# EAGLE design OK předzesilovač (EAGLE 9.6.2)
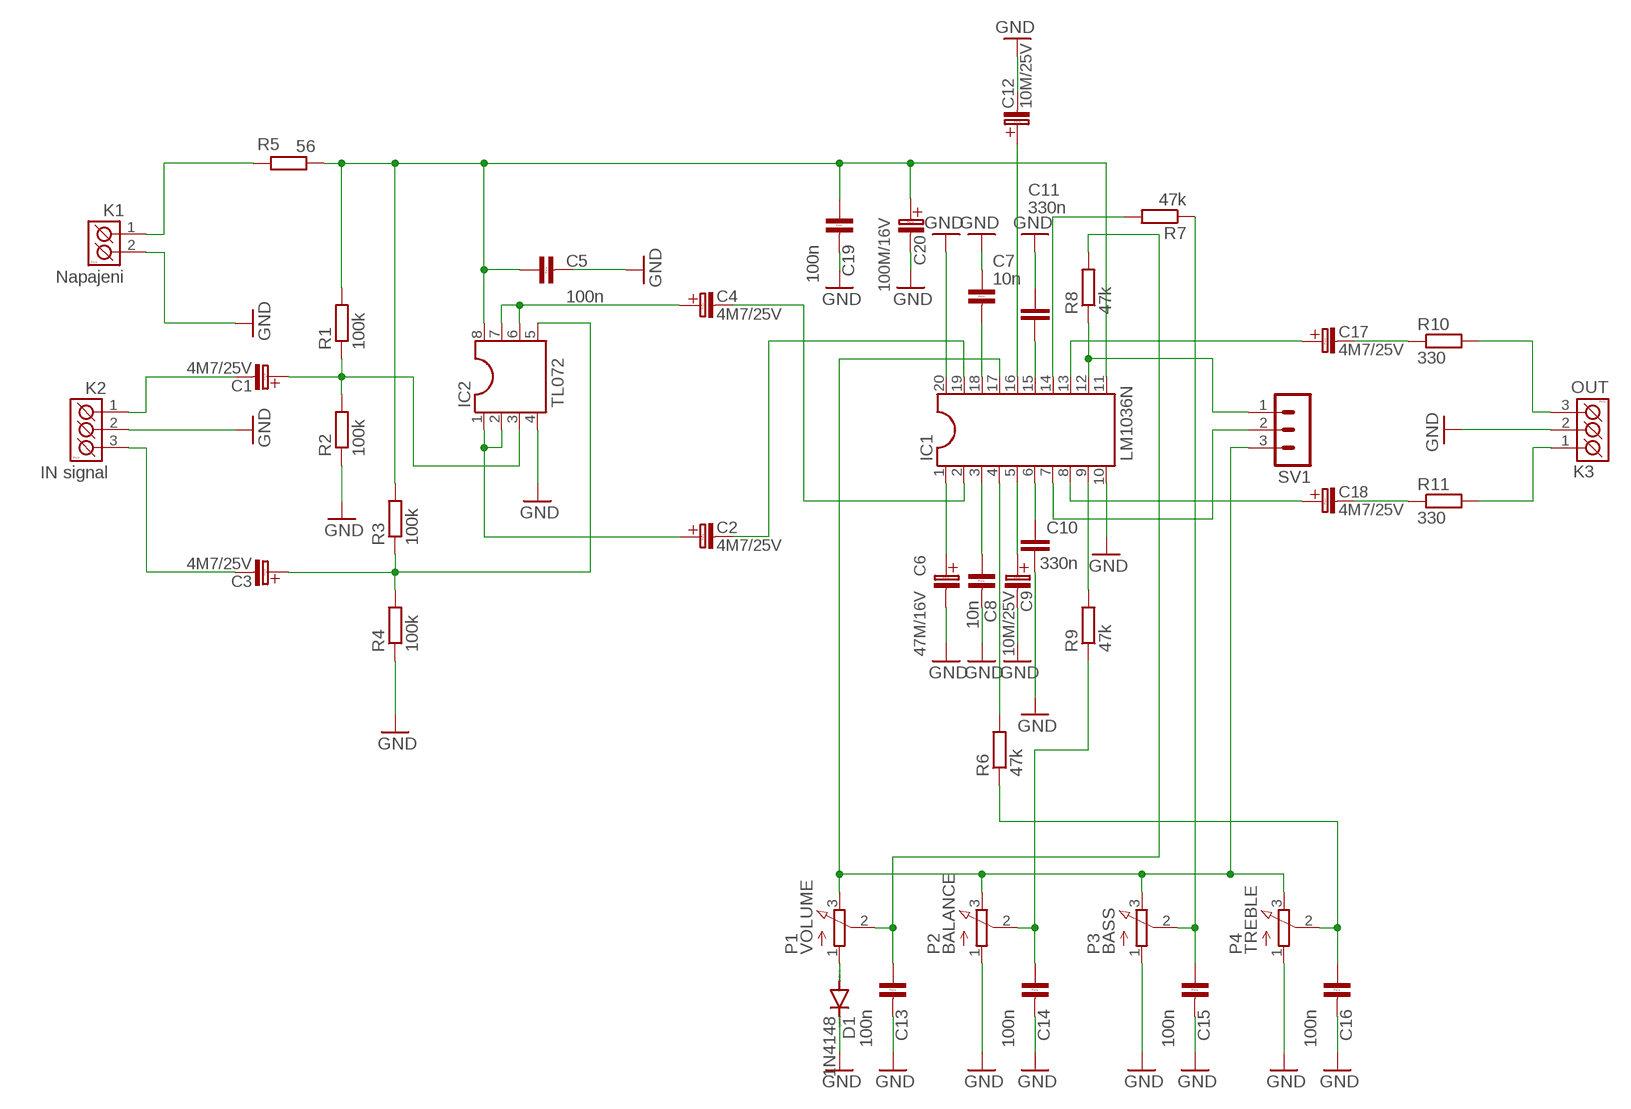
[diagram p0: schematic, sheet 1]

## Parts
C1  4M7/25V  4M7/63V  [C_EL_2]
C2  4M7/25V  4M7/63V  [C_EL_2]
C3  4M7/25V  4M7/63V  [C_EL_2]
C4  4M7/25V  4M7/63V  [C_EL_2]
C5  100n  100N-J/63V  [RM5_2,5]
C6  47M/16V  47M/10V  [C_EL_2]
C7  10n  10N-J/63V  [RM5_2,5]
C8  10n  10N-J/63V  [RM5_2,5]
C9  10M/25V  10M/100V  [C_EL_2,5]
C10  330n  C-EU075-032X103  [C075-032X103]
C11  330n  C-EU075-032X103  [C075-032X103]
C12  10M/25V  10M/100V  [C_EL_2,5]
C13  100n  100N-J/63V  [RM5_2,5]
C14  100n  100N-J/63V  [RM5_2,5]
C15  100n  100N-J/63V  [RM5_2,5]
C16  100n  100N-J/63V  [RM5_2,5]
C17  4M7/25V  4M7/63V  [C_EL_2]
C18  4M7/25V  4M7/63V  [C_EL_2]
C19  100n  100N-J/63V  [RM5_2,5]
C20  100M/16V  100M/50V  [C_EL_3,5]
D1  1N4148  1N4148DO35-7  [DO35-7]
IC1  LM1036N  DIL20  [DIL20]
IC2  TL072  DIL8  [DIL08]
K1  Napajeni  ARK500/2  [ARK500/2]
K2  IN signal  ARK500/3  [ARK500/3]
K3  OUT  ARK500/3  [ARK500/3]
P1  VOLUME  3RP/1610N  [3RP/1610N]
P2  BALANCE  3RP/1610N  [3RP/1610N]
P3  BASS  3RP/1610N  [3RP/1610N]
P4  TREBLE  3RP/1610N  [3RP/1610N]
R1  100k  R-EU_0207/12  [0207/12]
R2  100k  R-EU_0204/7  [0204/7]
R3  100k  R-EU_0204/7  [0204/7]
R4  100k  R-EU_0204/7  [0204/7]
R5  56  R-EU_0204/7  [0204/7]
R6  47k  R-EU_0207/12  [0207/12]
R7  47k  R-EU_0207/12  [0207/12]
R8  47k  R-EU_0207/12  [0207/12]
R9  47k  R-EU_0207/12  [0207/12]
R10  330  R-EU_0204/7  [0204/7]
R11  330  R-EU_0207/12  [0207/12]
SV1  MA03-1  [MA03-1]

## Nets
GND: C5.2 C6.C-(C_EL-) C7.1 C8.2 C9.C-(C_EL-) C10.2 C11.1 C12.C-(C_EL-) C13.2 C14.2 C15.2 C16.2 C19.2 C20.C-(C_EL-) D1.C IC1.10 IC1.20 IC2.4 K1.2(K2) K2.2(K2) K3.2(K2) P2.1(A) P3.1(A) P4.1(A) R2.1 R4.1
N$1: K3.1(K1) R11.2
N$2: K1.1(K1) R5.2
N$3: C1.C-(C_EL-) K2.1(K1)
N$4: C3.C+(C_EL+) IC2.5 R3.1 R4.2
N$5: C3.C-(C_EL-) K2.3(K3)
N$6: C4.C+(C_EL+) IC2.6 IC2.7
N$7: IC1.14 R7.2
N$8: D1.A P1.1(A)
N$9: C1.C+(C_EL+) IC2.3 R1.1 R2.2
N$10: C2.C+(C_EL+) IC2.1 IC2.2
N$11: C2.C-(C_EL-) IC1.19
N$12: C4.C-(C_EL-) IC1.2
N$13: C6.C+(C_EL+) IC1.1
N$14: C9.C+(C_EL+) IC1.5
N$15: C11.2 IC1.15
N$16: C7.2 IC1.18
N$18: C13.1 P1.2(S) R8.2
N$19: C14.1 P2.2(S) R9.1
N$20: C15.1 P3.2(S) R7.1
N$21: C16.1 P4.2(S) R6.1
N$22: IC1.7 SV1.2
N$23: C12.C+(C_EL+) IC1.16
N$24: K3.3(K3) R10.2
N$25: C17.C-(C_EL-) R10.1
N$26: C17.C+(C_EL+) IC1.13
N$27: IC1.17 P1.3(E) P2.3(E) P3.3(E) P4.3(E) SV1.3
N$28: C10.1 IC1.6
N$29: C18.C+(C_EL+) IC1.8
N$30: C18.C-(C_EL-) R11.1
N$31: C8.1 IC1.3
N$32: IC1.4 R6.2
N$33: IC1.12 R8.1 SV1.1
N$35: C5.1 C19.1 C20.C+(C_EL+) IC1.11 IC2.8 R1.2 R3.2 R5.1
N$36: IC1.9 R9.2

## Library data of the parts
C1-C4 C17 C18 = #PaJa_C-el_2:4M7/63V
C5 C13-C16 C19 = #PaJa_C-folie:100N-J/63V
C6 = #PaJa_C-el_2:47M/10V
C7 C8 = #PaJa_C-folie:10N-J/63V
C9 C12 = #PaJa_C-el_2:10M/100V
C10 C11 = rcl:C-EU: CAPACITOR, European symbol; SPICEPREFIX: C
C20 = #PaJa_C-el_2:100M/50V
D1 = diode:1N4148: DIODE high speed (Philips)
IC1 = ic-package:DIL20: Dual In Line / Socket
IC2 = ic-package:DIL8: Dual In Line / Socket
K1 = #PaJa_konektory:ARK500/2: Svorkovnice - roztec 5mm - dvojita
K2 K3 = #PaJa_konektory:ARK500/3: Svorkovnice - roztec 5mm - trojita
P1-P4 = pot:3RP/1610N: 16mm Potentiometer one level Source: http://www.alphapotentiometers.net/html/16mm_pot_2.html
R1-R11 = rcl:R-EU_: RESISTOR, European symbol; SPICEPREFIX: R
SV1 = con-lstb:MA03-1: PIN HEADER; OC_FARNELL: unknown; OC_NEWARK: unknown

## Board
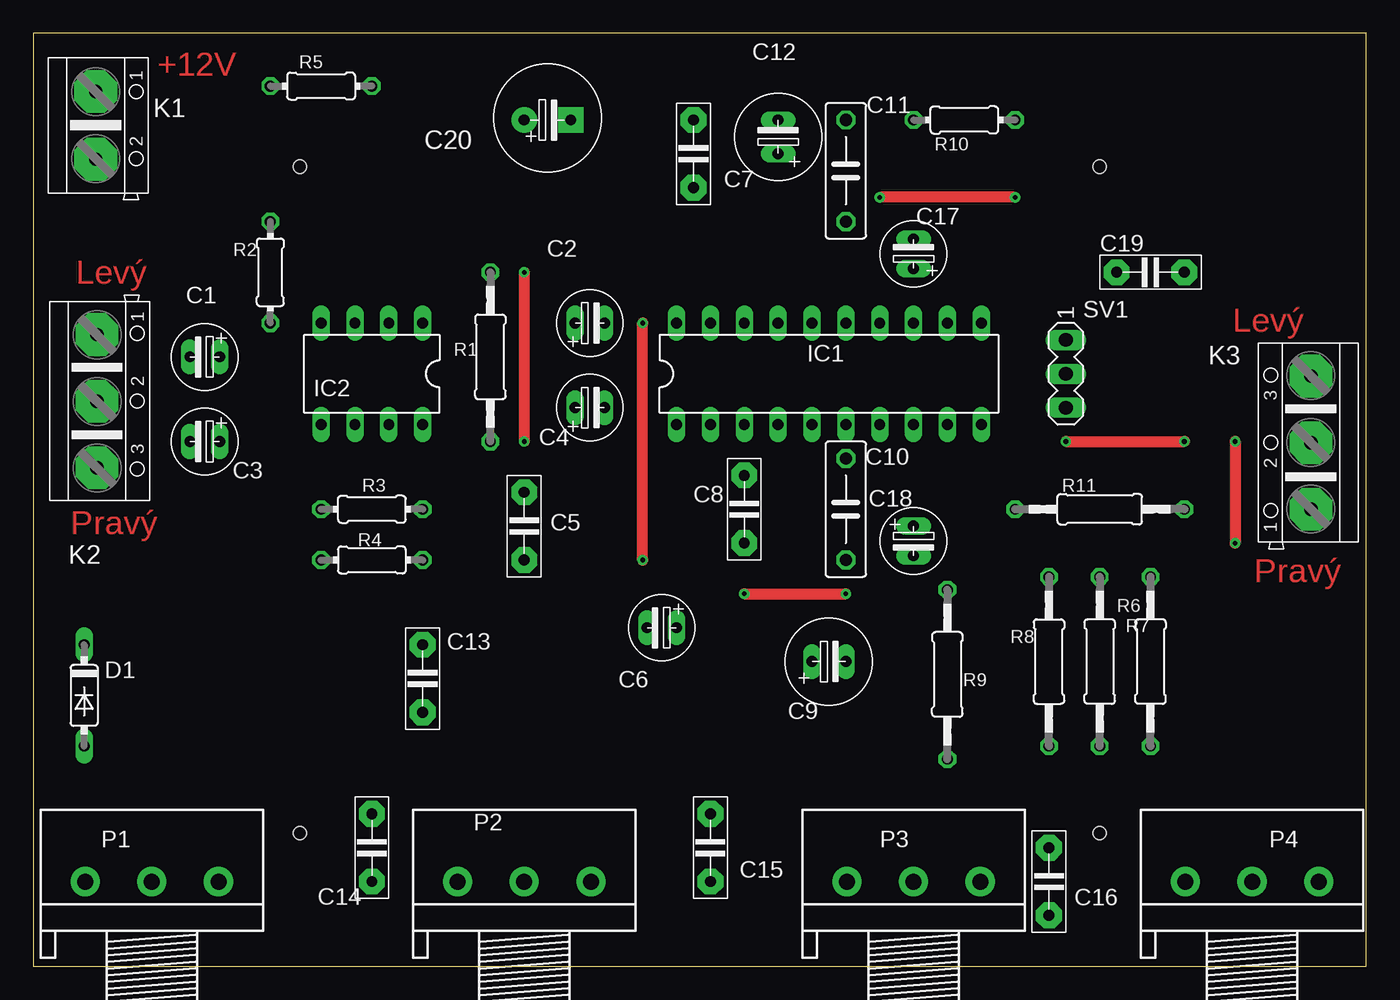
[diagram p1: board, top side]
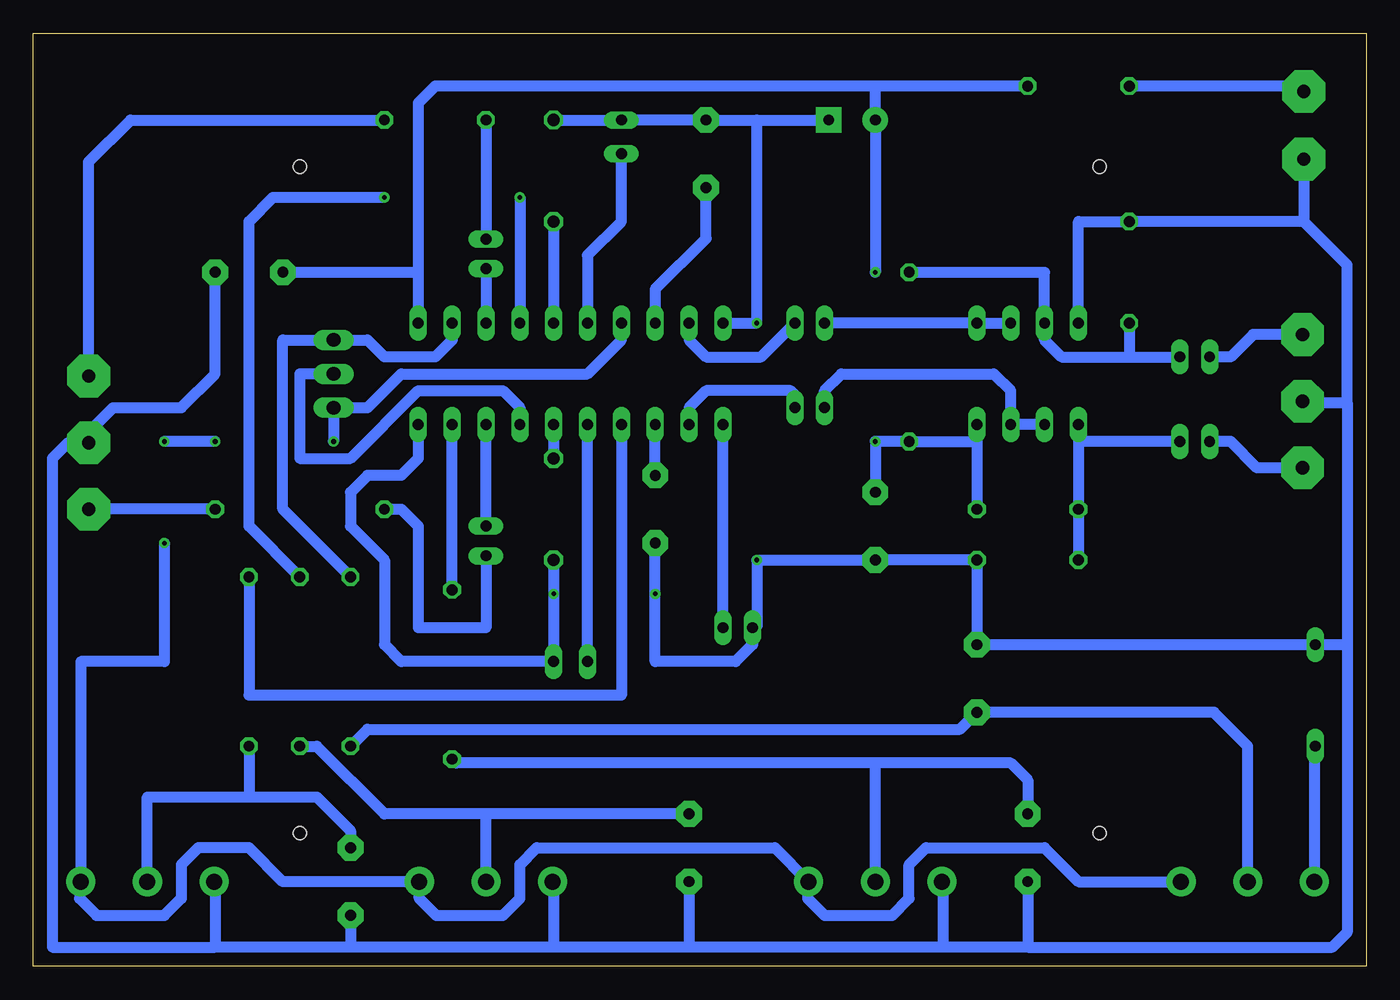
[diagram p2: board, bottom side, seen from below]

Size 100 x 70 mm. Coordinates in mm from the lower left corner, seen from the top.
Outline: 0,0 100,0 100,70 0,70 0,0
Copper layers (1*16): Top 0.035mm / dielectric 1.5mm / Bottom 0.035mm
Design rules "default": minimum track width 6mil, minimum drill 0.35mm, track to track 6mil, track to pad 6mil, pad to pad 6mil, via to via 6mil, smd to smd 6mil, copper to edge 40mil, drill to drill 6mil, minimum pad ring 10mil, minimum via ring 8mil, stop-mask expansion 4mil, vias tented up to drill 0mil, thermal gap 10mil
Holes 1 mm at 20,10 20,60 80,60 80,10

### Footprints (pad centres in the part's own frame; a part is rotated, then mirrored left to right if it is on the bottom)
C_EL_2 = drill 0.813 pad 1.27 long: C+ 0,0; C- 2.223,0
RM5_2,5 = drill 0.813 pad 1.93 octagon: 1 -2.54,0; 2 2.54,0
C_EL_2,5 = drill 0.813 pad 1.27 long: C+ -1.27,0; C- 1.27,0
C075-032X103 = drill 0.914 octagon: 1 -3.81,0; 2 3.81,0
C_EL_3,5 = drill 0.813 pad 1.93: C+ 0,0 | drill 0.813 pad 1.93 square: C- 3.493,0
DO35-7 = drill 0.813 long: A 3.81,0; C -3.81,0
DIL20 = drill 0.813 long: 1 -11.43,-3.81; 2 -8.89,-3.81; 3 -6.35,-3.81; 4 -3.81,-3.81; 5 -1.27,-3.81; 6 1.27,-3.81; 7 3.81,-3.81; 8 6.35,-3.81; 9 8.89,-3.81; 10 11.43,-3.81; 11 11.43,3.81; 12 8.89,3.81; 13 6.35,3.81; 14 3.81,3.81; 15 1.27,3.81; 16 -1.27,3.81; 17 -3.81,3.81; 18 -6.35,3.81; 19 -8.89,3.81; 20 -11.43,3.81
DIL08 = drill 0.813 long: 1 -3.81,-3.81; 2 -1.27,-3.81; 3 1.27,-3.81; 4 3.81,-3.81; 5 3.81,3.81; 6 1.27,3.81; 7 -1.27,3.81; 8 -3.81,3.81
ARK500/2 = drill 1 pad 3.2 octagon: 1 -2.54,0; 2 2.54,0
ARK500/3 = drill 1 pad 3.2 octagon: 1 -5,0; 2 0,0; 3 5,0
3RP/1610N = drill 1.2 pad 2.184: 1 -5,0; 2 0,0; 3 5,0
0207/12 = drill 0.813 octagon: 1 -6.35,0; 2 6.35,0
0204/7 = drill 0.813 octagon: 1 -3.81,0; 2 3.81,0
MA03-1 = drill 1.016 long: 1 -2.54,0; 2 0,0; 3 2.54,0

### Placement (x,y rotation side)
C1  13.97,45.72 180 top
C2  40.64,48.26 0 top
C3  13.97,39.37 180 top
C4  40.64,41.91 0 top
C5  36.83,33.02 270 top
C6  48.26,25.4 180 top
C7  49.53,60.96 270 top
C8  53.34,34.29 270 top
C9  59.69,22.86 0 top
C10  60.96,34.29 270 top
C11  60.96,59.69 270 top
C12  55.88,62.23 90 top
C13  29.21,21.59 90 top
C14  25.4,8.89 270 top
C15  50.8,8.89 270 top
C16  76.2,6.35 270 top
C17  66.04,52.34 90 top
C18  66.04,33.02 270 top
C19  83.82,52.07 0 top
C20  36.83,63.5 0 top
D1  3.81,20.32 270 top
IC1  59.69,44.45 0 top
IC2  25.4,44.45 180 top
K1  4.68,63.1 270 top
K2  4.78,42.4 270 top
K3  95.85,39.28 90 top
P1  8.89,6.35 0 top
P2  36.83,6.35 0 top
P3  66.04,6.35 0 top
P4  91.44,6.35 0 top
R1  34.29,45.72 270 top
R2  17.78,52.07 270 top
R3  25.4,34.29 0 top
R4  25.4,30.48 180 top
R5  21.59,66.04 180 top
R6  83.82,22.86 90 top
R7  80.01,22.86 90 top
R8  76.2,22.86 270 top
R9  68.58,21.89 90 top
R10  69.85,63.5 0 top
R11  80.01,34.29 0 top
SV1  77.47,44.45 270 top

### Tracks (layer width: path | path; a pad name or v marks a point on that pad's centre or on a via)
GND  (via drill 0.35)
  Top 0.813: v45.72,30.48 v45.72,48.26 | v53.34,27.94 v60.96,27.94
  Bottom 0.813: 25.4,1.42 31.75,1.42 | 31.75,1.42 50.8,1.42 | 50.8,1.42 60.96,1.42 | 60.96,1.42 76.2,1.42 | 76.2,1.42 86.36,1.42 | C14.2 25.4,1.42 | C15.2 50.8,1.42 | 25.4,1.42 2.54,1.42 1.42,2.54 1.42,24.13 | C11.1 C12.C- C7.1 45.72,63.5 | C19.2 86.36,44.45 88.9,41.91 94.02,41.91 95.85,40.08 K3.2 97.4,39.28 98.58,38.1 98.58,1.42 86.36,1.42 | C8.2 v53.34,27.94 53.34,22.86 47.31,22.86 46.04,24.13 C6.C- 45.72,25.46 v45.72,30.48 C5.2 R4.1 C13.2 D1.C 1.42,24.13 | 1.42,42.31 1.42,24.13 | IC1.10 71.12,38.1 72.39,36.83 74.93,36.83 76.2,35.56 76.2,33.02 73.66,30.48 73.66,24.13 72.39,22.86 C9.C- v60.96,27.94 C10.2 | 45.72,63.5 C20.C- | IC1.20 v45.72,48.26 45.72,63.5 | IC2.4 21.59,55.88 R2.1 4.68,55.88 | K2.2 4.69,42.31 1.42,42.31 | P2.1 31.75,6.27 31.75,1.42 | P4.1 86.36,6.27 86.36,1.42 | P3.1 60.96,6.27 60.96,1.42 | C16.2 76.2,1.42 | K1.2 4.68,55.88 | 4.68,55.88 1.42,52.62 1.42,42.31
N$1
  Bottom 0.813: R11.2 K3.1
N$2
  Bottom 0.813: K1.1 5.08,66.04 R5.2
N$3
  Bottom 0.813: K2.1 8.48,47.4 10.16,45.72 C1.C-
N$4
  Bottom 0.813: IC2.5 21.59,39.37 | 21.59,39.37 R3.1 R4.2 | C3.C+ 21.59,39.37
N$5
  Bottom 0.813: K2.3 8.19,37.4 10.16,39.37 C3.C-
N$6
  Bottom 0.813: IC2.6 IC2.7 26.67,43.18 27.94,44.45 39.37,44.45 40.64,43.18 C4.C+
N$7  (via drill 0.35)
  Top 0.813: v73.66,57.69 v63.5,57.69
  Bottom 0.813: v63.5,57.69 IC1.14 | R7.2 83.82,33.02 83.82,55.88 82.01,57.69 v73.66,57.69
N$8
  Bottom 0.813: D1.A 3.89,16.43 P1.1
N$9
  Bottom 0.813: 17.78,45.72 22.86,45.72 24.13,46.99 IC2.3 24.13,52.07 R1.1 | 17.78,45.72 C1.C+ | R2.2 17.78,45.72
N$10
  Bottom 0.813: IC2.2 IC2.1 C2.C+
N$11
  Bottom 0.813: IC1.19 50.8,46.99 49.53,45.72 45.4,45.72 C2.C-
N$12
  Bottom 0.813: IC1.2 50.8,41.91 49.53,43.18 43.18,43.18 42.86,42.86 C4.C-
N$13
  Bottom 0.813: C6.C+ IC1.1
N$14
  Bottom 0.813: C9.C+ IC1.5
N$15
  Bottom 0.813: C11.2 IC1.15
N$16
  Bottom 0.813: IC1.18 53.34,50.8 49.53,54.61 C7.2
N$18
  Bottom 0.813: R8.2 74.93,17.78 30.48,17.78 C13.1 11.43,19.05 8.89,16.51 P1.2
N$19
  Bottom 0.813: 36.83,15.24 26.67,15.24 25.4,13.97 C14.1 | 36.83,15.24 68.28,15.24 R9.1 | P2.2 36.83,15.24
N$20
  Bottom 0.813: C15.1 66.04,11.43 | 66.04,11.43 73.66,11.43 78.74,16.51 R7.1 | P3.2 66.04,11.43
N$21
  Bottom 0.813: P4.2 91.44,12.7 83.82,12.7 | 83.82,12.7 78.74,12.7 76.2,10.16 C16.1 | R6.1 83.82,12.7
N$22
  Bottom 0.813: SV1.2 80.01,44.45 80.01,38.1 76.2,38.1 71.12,43.18 64.77,43.18 63.5,41.91 IC1.7
N$23
  Bottom 0.813: IC1.16 58.42,53.34 55.88,55.88 C12.C+
N$24
  Bottom 0.813: R10.2 92.71,63.5 95.85,60.36 K3.3
N$25
  Bottom 0.813: R10.1 C17.C-
N$26
  Bottom 0.813: C17.C+ IC1.13
N$27  (via drill 0.35)
  Top 0.813: v77.47,39.37 v86.36,39.37 | v90.17,39.37 v90.17,31.75
  Bottom 0.813: IC1.17 55.88,46.99 58.42,44.45 72.39,44.45 74.93,41.91 SV1.3 v77.47,39.37 | v86.36,39.37 v90.17,39.37 | v90.17,31.75 90.17,22.86 96.44,22.86 P4.3 96.52,6.27 96.52,5.08 95.25,3.81 90.17,3.81 88.9,5.08 88.9,7.62 87.63,8.89 83.82,8.89 81.28,6.35 P3.3 71.04,5.08 69.77,3.81 64.77,3.81 63.5,5.08 63.5,7.62 62.23,8.89 44.37,8.89 P2.3 41.91,6.27 41.91,5.08 40.64,3.81 35.56,3.81 34.29,5.08 34.29,7.62 33.02,8.89 24.13,8.89 21.59,6.35 P1.3
N$28
  Bottom 0.813: IC1.6 C10.1
N$29
  Bottom 0.813: C18.C+ IC1.8
N$30
  Bottom 0.813: R11.1 72.39,34.29 71.12,33.02 71.12,25.4 66.04,25.4 C18.C-
N$31
  Bottom 0.813: C8.1 IC1.3
N$32
  Bottom 0.813: IC1.4 55.88,20.32 83.82,20.32 R6.2
N$33
  Bottom 0.813: R8.1 81.28,34.29 81.28,46.99 SV1.1 74.93,46.99 73.66,45.72 69.85,45.72 68.58,46.99 IC1.12
N$35  (via drill 0.35)
  Top 0.813: v36.83,52.07 v36.83,39.37
  Bottom 0.813: C5.1 v36.83,39.37 R1.2 29.21,39.37 | IC2.8 29.21,39.37 | 29.21,39.37 R3.2 | 71.12,52.07 71.12,64.77 69.85,66.04 36.83,66.04 | 71.12,52.07 IC1.11 | C19.1 71.12,52.07 | R5.1 36.83,66.04 | 36.83,66.04 C20.C+ v36.83,52.07
N$36
  Bottom 0.813: R9.2 IC1.9

### Text on the board
Top: +12V | Levý | Levý | Pravý | Pravý